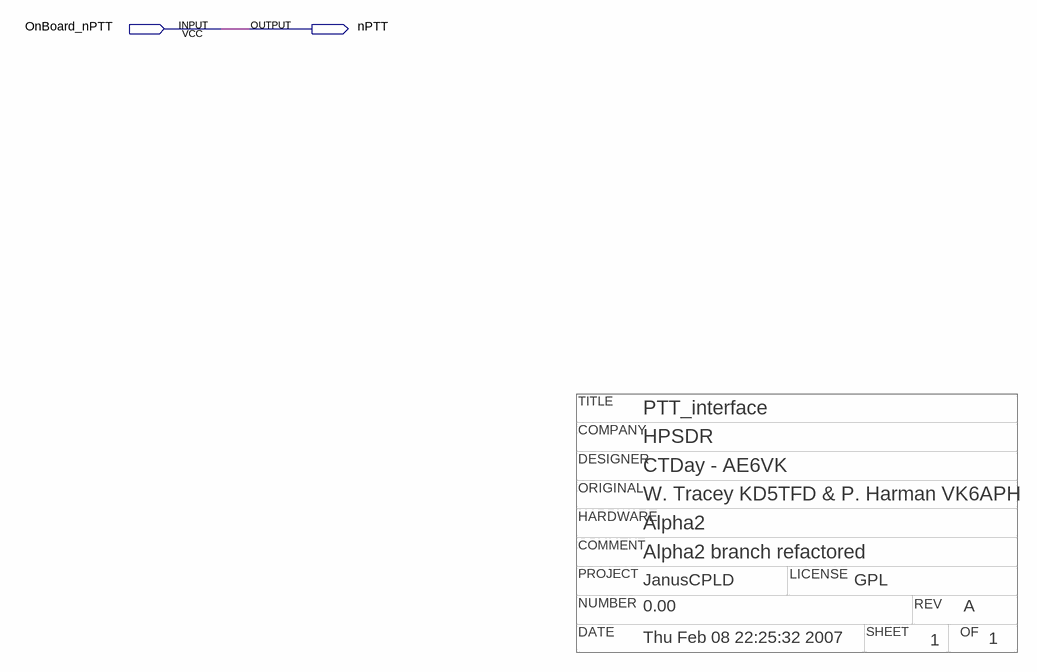
[diagram p0: schematic sheet]
// Quartus schematic PTT_interface.bdf as structural Verilog: 0 symbols, 2 pins
// Title block: TITLE: PTT_interface; COMPANY: HPSDR; DESIGNER: CTDay - AE6VK; NUMBER: 0.00; REV: A; DATE: Thu Feb 08 22:25:32 2007; SHEET: 1; OF: 1; ORIGINAL: W. Tracey KD5TFD & P. Harman VK6APH; HARDWARE: Alpha2; COMMENT: Alpha2 branch refactored; PROJECT: JanusCPLD; LICENSE: GPL
module PTT_interface (
  input  OnBoard_nPTT,
  output nPTT
);


  assign nPTT = OnBoard_nPTT;
endmodule
